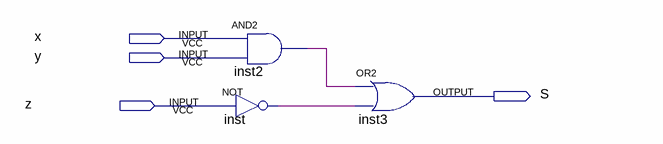
[diagram p0: schematic sheet]
// Quartus schematic misc_1.bdf as structural Verilog: 3 symbols, 4 pins
module misc_1 (
  input  x,
  input  y,
  input  z,
  output S
);

  wire inst2_out, inst_out;

  and inst2 (inst2_out, x, y);
  not inst (inst_out, z);
  or inst3 (S, inst2_out, inst_out);
endmodule
